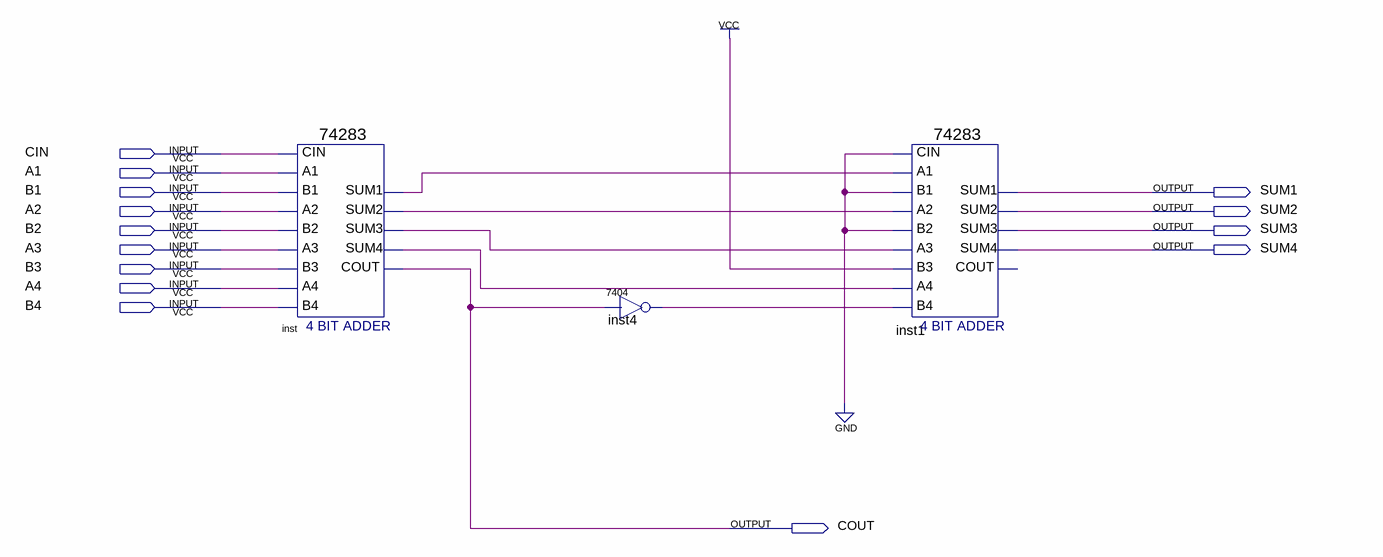
[diagram p0: schematic sheet]
// Quartus schematic 3improve.bdf as structural Verilog: 3 symbols, 14 pins
module \3improve  (
  input  CIN,
  input  A1,
  input  B1,
  input  A2,
  input  B2,
  input  A3,
  input  B3,
  input  A4,
  input  B4,
  output SUM1,
  output SUM2,
  output SUM3,
  output SUM4,
  output COUT
);

  wire inst4_1, inst_sum1, inst_sum2, inst_sum3, inst_sum4;

  \74283  inst (
    .CIN(CIN), .A1(A1), .A2(A2), .B2(B2), .A3(A3), .A4(A4), .B4(B4), .B1(B1), .B3(B3), .SUM4(inst_sum4),
    .COUT(COUT), .SUM1(inst_sum1), .SUM2(inst_sum2), .SUM3(inst_sum3));
  \7404  inst4 (.\2 (COUT), .\1 (inst4_1));
  \74283  inst1 (
    .CIN(1'b0), .A1(inst_sum1), .A2(inst_sum2), .B2(1'b0), .A3(inst_sum3), .A4(inst_sum4), .B4(inst4_1),
    .B1(1'b0), .B3(1'b1), .SUM4(SUM4), .SUM1(SUM1), .SUM2(SUM2), .SUM3(SUM3));  // open: COUT
endmodule
